# Altium schematic sheet 23_LMS2_RX1_BB_ADC.SchDoc: LMS2 RX1 BB ADC
size A3; Organization: Lime Microsystems; Address1: Surrey Tech Centre; Address2: Guildford GU2 7YG; Address3: Surrey; Address4: United Kingdom; Revision: v1.1; SheetNumber: 23; SheetTotal: 31
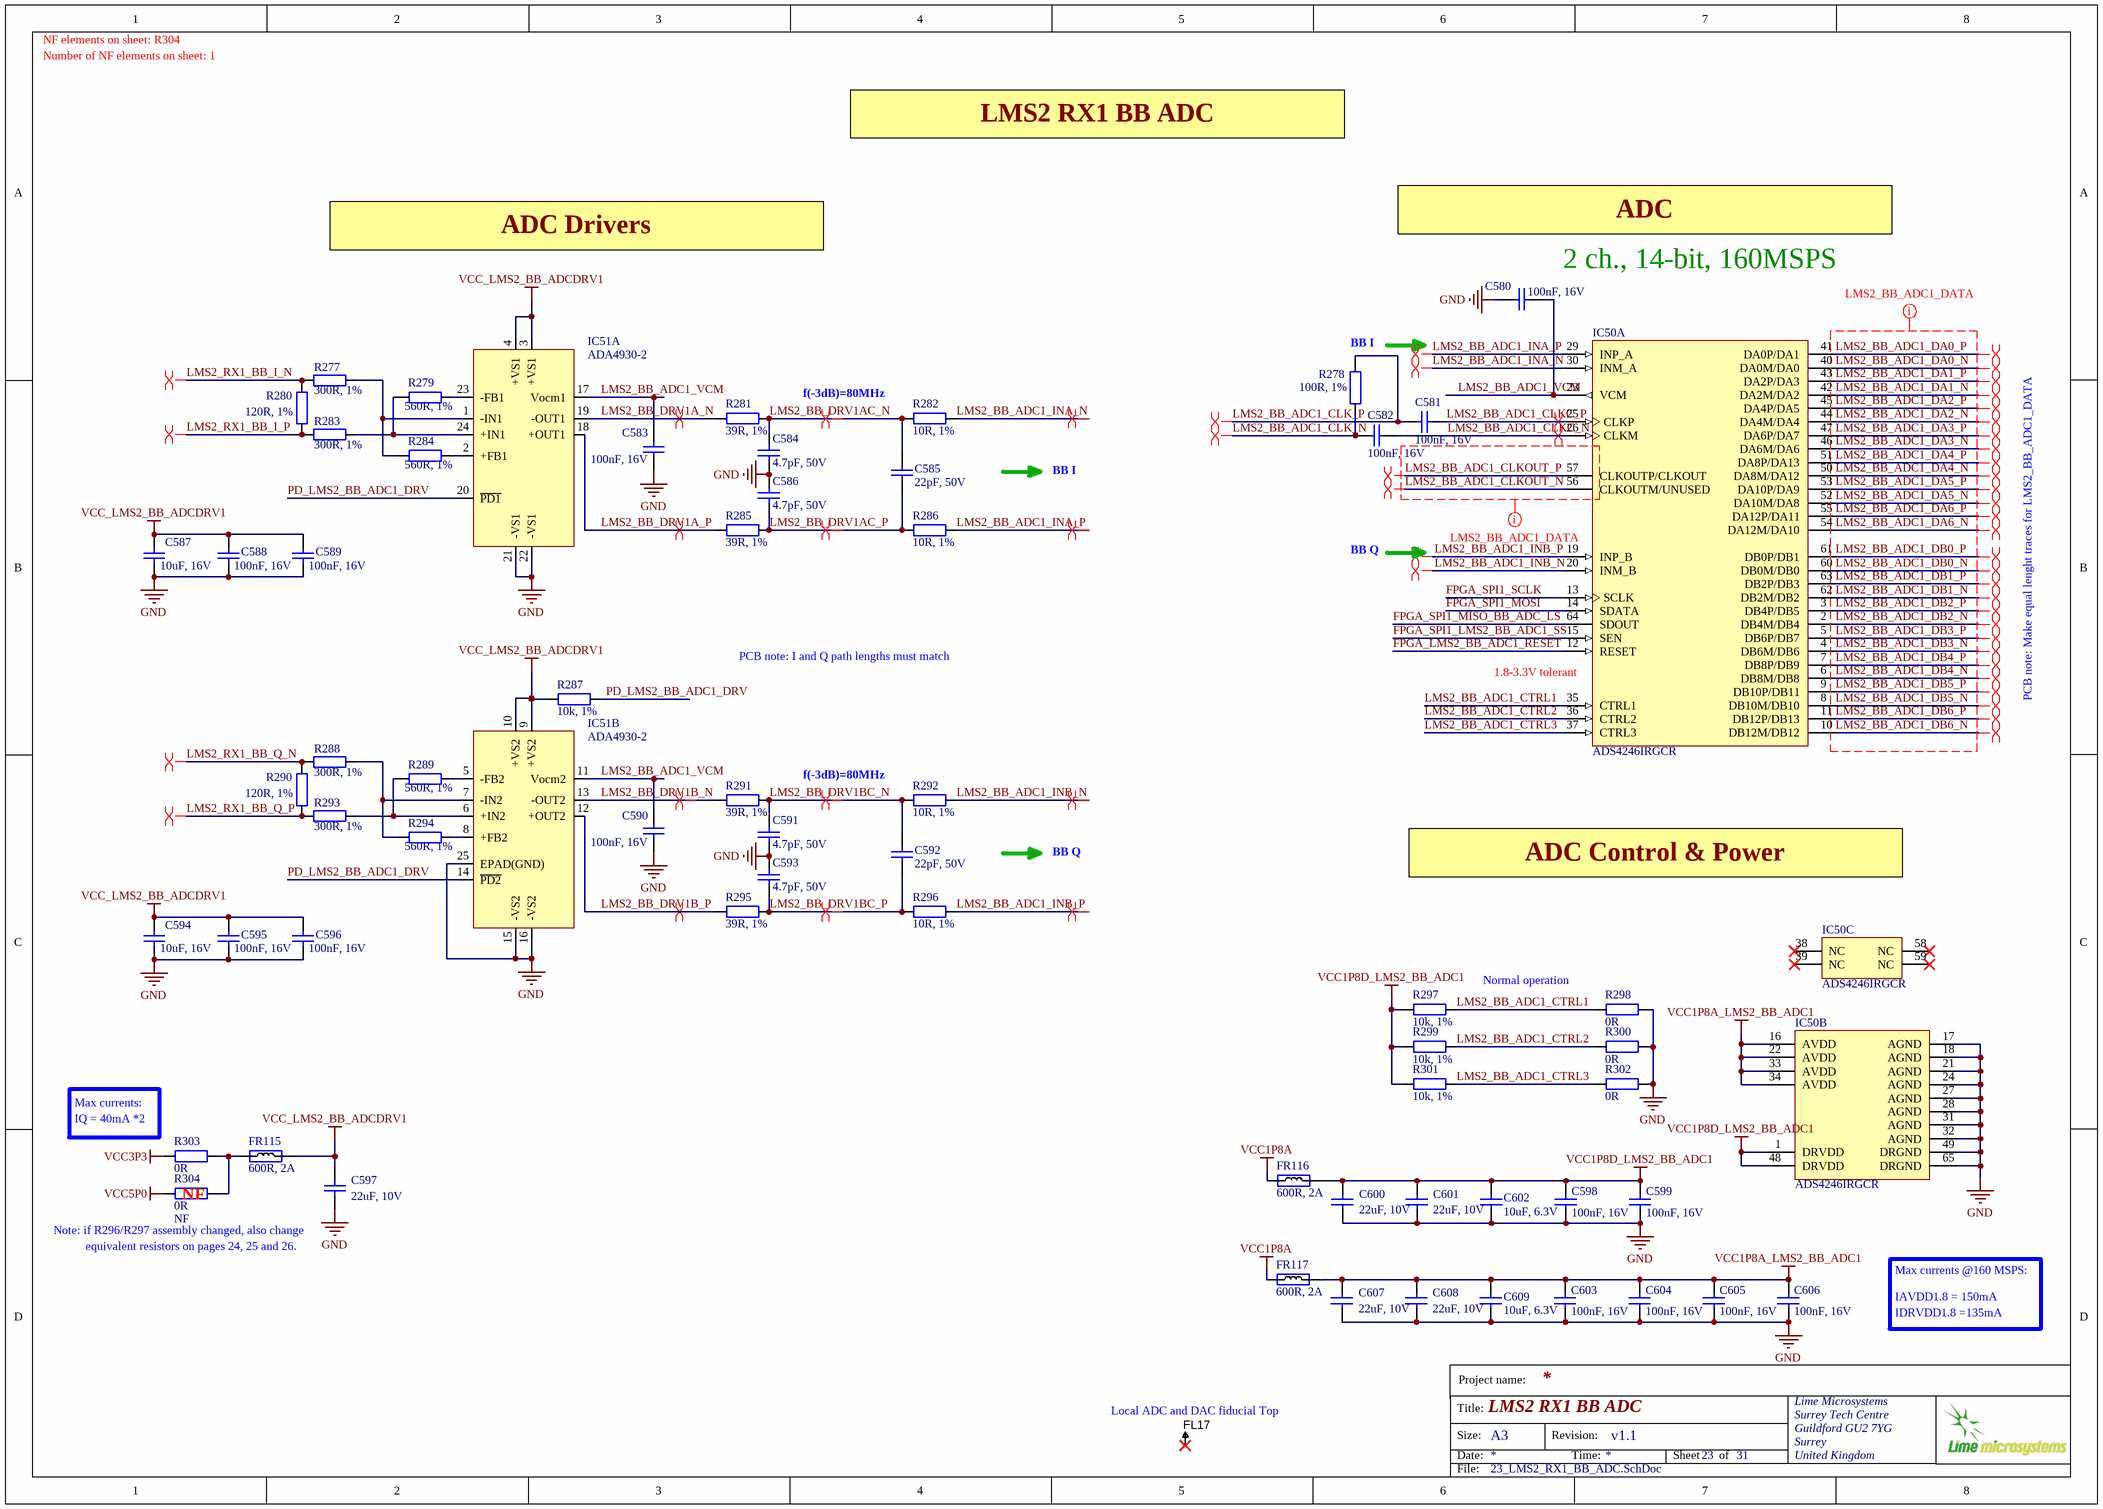
[diagram p0: 23_LMS2_RX1_BB_ADC.SchDoc]

## Parts
C580  100nF, 16V  [CAP0402]
C581  100nF, 16V  [CAP0402]
C582  100nF, 16V  [CAP0402]
C583  100nF, 16V  [CAP0402]
C584  4.7pF, 50V  [CAP0402]
C585  22pF, 50V  [CAP0402]
C586  4.7pF, 50V  [CAP0402]
C587  10uF, 16V  [CAP0603]
C588  100nF, 16V  [CAP0402]
C589  100nF, 16V  [CAP0402]
C590  100nF, 16V  [CAP0402]
C591  4.7pF, 50V  [CAP0402]
C592  22pF, 50V  [CAP0402]
C593  4.7pF, 50V  [CAP0402]
C594  10uF, 16V  [CAP0603]
C595  100nF, 16V  [CAP0402]
C596  100nF, 16V  [CAP0402]
C597  22uF, 10V  [CAP0603]
C598  100nF, 16V  [CAP0402]
C599  100nF, 16V  [CAP0402]
C600  22uF, 10V  [CAP0603]
C601  22uF, 10V  [CAP0603]
C602  10uF, 6.3V  [CAP0603]
C603  100nF, 16V  [CAP0402]
C604  100nF, 16V  [CAP0402]
C605  100nF, 16V  [CAP0402]
C606  100nF, 16V  [CAP0402]
C607  22uF, 10V  [CAP0603]
C608  22uF, 10V  [CAP0603]
C609  10uF, 6.3V  [CAP0603]
FL17  Fiducial  [Fiducial_local]  (value not drawn)
FR115  600R, 2A  [RES0805]
FR116  600R, 2A  [RES0805]
FR117  600R, 2A  [RES0805]
IC50  ADS4246IRGCR  [TI-RGC64-7400X7400TP_V]  (parts A,B,C of 3)
IC51  ADA4930-2  [ADA4930-2_LFCSP-24]  (parts A,B of 2)
R277  300R, 1%  [RES0402]
R278  100R, 1%  [RES0402]
R279  560R, 1%  [RES0402]
R280  120R, 1%  [RES0402]
R281  39R, 1%  [RES0402]
R282  10R, 1%  [RES0402]
R283  300R, 1%  [RES0402]
R284  560R, 1%  [RES0402]
R285  39R, 1%  [RES0402]
R286  10R, 1%  [RES0402]
R287  10k, 1%  [RES0402]
R288  300R, 1%  [RES0402]
R289  560R, 1%  [RES0402]
R290  120R, 1%  [RES0402]
R291  39R, 1%  [RES0402]
R292  10R, 1%  [RES0402]
R293  300R, 1%  [RES0402]
R294  560R, 1%  [RES0402]
R295  39R, 1%  [RES0402]
R296  10R, 1%  [RES0402]
R297  10k, 1%  [RES0402]
R298  0R  [RES0402]
R299  10k, 1%  [RES0402]
R300  0R  [RES0402]
R301  10k, 1%  [RES0402]
R302  0R  [RES0402]
R303  0R  [RES0402]
R304  0R  Assembly Info: NF  [RES0402]

## Nets
GND: C580.1 C583.2 C584.2 C586.1 C587.1 C588.2 C589.2 C590.2 C591.2 C593.1 C594.1 C595.2 C596.2 C597.1 C598.1 C599.1 C600.1 C601.1 C602.2 C603.1 C604.1 C605.1 C606.1 C607.1 C608.1 C609.2 IC50.17(AGND) IC50.18(AGND) IC50.21(AGND) IC50.24(AGND) IC50.27(AGND) IC50.28(AGND) IC50.31(AGND) IC50.32(AGND) IC50.49(DRGND) IC50.65(DRGND) IC51.15(-VS2) IC51.16(-VS2) IC51.21(-VS1) IC51.22(-VS1) IC51.25(EPAD(GND)) R298.1 R300.1 R302.1
VCC1P8A: FR116.1 FR117.1
VCC1P8A_LMS2_BB_ADC1: C603.2 C604.2 C605.2 C606.2 C607.2 C608.2 C609.1 FR117.2 IC50.16(AVDD) IC50.22(AVDD) IC50.33(AVDD) IC50.34(AVDD)
VCC1P8D_LMS2_BB_ADC1: C598.2 C599.2 C600.2 C601.2 C602.1 FR116.2 IC50.1(DRVDD) IC50.48(DRVDD) R297.2 R299.2 R301.2
VCC3P3: R303.2
VCC5P0: R304.2
VCC_LMS2_BB_ADCDRV1: C587.2 C588.1 C589.1 C594.2 C595.1 C596.1 C597.2 FR115.2 IC51.3(+VS1) IC51.4(+VS1) IC51.9(+VS2) IC51.10(+VS2) R287.2
FPGA_LMS2_BB_ADC1_RESET: IC50.12(RESET)
FPGA_SPI1_LMS2_BB_ADC1_SS: IC50.15(SEN)
FPGA_SPI1_MISO_BB_ADC_LS: IC50.64(SDOUT)
FPGA_SPI1_MOSI: IC50.14(SDATA)
FPGA_SPI1_SCLK: IC50.13(SCLK)
LMS2_BB_ADC1_CLK_N: C582.2 R278.1
LMS2_BB_ADC1_CLK_P: C581.2 R278.2
LMS2_BB_ADC1_CLKC_N: C582.1 IC50.26(CLKM)
LMS2_BB_ADC1_CLKC_P: C581.1 IC50.25(CLKP)
LMS2_BB_ADC1_CLKOUT_N: IC50.56(CLKOUTM/UNUSED)
LMS2_BB_ADC1_CLKOUT_P: IC50.57(CLKOUTP/CLKOUT)
LMS2_BB_ADC1_CTRL1: IC50.35(CTRL1) R297.1 R298.2
LMS2_BB_ADC1_CTRL2: IC50.36(CTRL2) R299.1 R300.2
LMS2_BB_ADC1_CTRL3: IC50.37(CTRL3) R301.1 R302.2
LMS2_BB_ADC1_DA0_N: IC50.40(DA0M/DA0)
LMS2_BB_ADC1_DA0_P: IC50.41(DA0P/DA1)
LMS2_BB_ADC1_DA1_N: IC50.42(DA2M/DA2)
LMS2_BB_ADC1_DA1_P: IC50.43(DA2P/DA3)
LMS2_BB_ADC1_DA2_N: IC50.44(DA4M/DA4)
LMS2_BB_ADC1_DA2_P: IC50.45(DA4P/DA5)
LMS2_BB_ADC1_DA3_N: IC50.46(DA6M/DA6)
LMS2_BB_ADC1_DA3_P: IC50.47(DA6P/DA7)
LMS2_BB_ADC1_DA4_N: IC50.50(DA8M/DA12)
LMS2_BB_ADC1_DA4_P: IC50.51(DA8P/DA13)
LMS2_BB_ADC1_DA5_N: IC50.52(DA10M/DA8)
LMS2_BB_ADC1_DA5_P: IC50.53(DA10P/DA9)
LMS2_BB_ADC1_DA6_N: IC50.54(DA12M/DA10)
LMS2_BB_ADC1_DA6_P: IC50.55(DA12P/DA11)
LMS2_BB_ADC1_DB0_N: IC50.60(DB0M/DB0)
LMS2_BB_ADC1_DB0_P: IC50.61(DB0P/DB1)
LMS2_BB_ADC1_DB1_N: IC50.62(DB2M/DB2)
LMS2_BB_ADC1_DB1_P: IC50.63(DB2P/DB3)
LMS2_BB_ADC1_DB2_N: IC50.2(DB4M/DB4)
LMS2_BB_ADC1_DB2_P: IC50.3(DB4P/DB5)
LMS2_BB_ADC1_DB3_N: IC50.4(DB6M/DB6)
LMS2_BB_ADC1_DB3_P: IC50.5(DB6P/DB7)
LMS2_BB_ADC1_DB4_N: IC50.6(DB8M/DB8)
LMS2_BB_ADC1_DB4_P: IC50.7(DB8P/DB9)
LMS2_BB_ADC1_DB5_N: IC50.8(DB10M/DB10)
LMS2_BB_ADC1_DB5_P: IC50.9(DB10P/DB11)
LMS2_BB_ADC1_DB6_N: IC50.10(DB12M/DB12)
LMS2_BB_ADC1_DB6_P: IC50.11(DB12P/DB13)
LMS2_BB_ADC1_INA_N: IC50.30(INM_A) R282.1
LMS2_BB_ADC1_INA_P: IC50.29(INP_A) R286.1
LMS2_BB_ADC1_INB_N: IC50.20(INM_B) R292.1
LMS2_BB_ADC1_INB_P: IC50.19(INP_B) R296.1
LMS2_BB_ADC1_VCM: C580.2 C583.1 C590.1 IC50.23(VCM) IC51.11(Vocm2) IC51.17(Vocm1)
LMS2_BB_DRV1A_N: IC51.19(-OUT1) R281.2
LMS2_BB_DRV1A_P: IC51.18(+OUT1) R285.2
LMS2_BB_DRV1AC_N: C584.1 C585.1 R281.1 R282.2
LMS2_BB_DRV1AC_P: C585.2 C586.2 R285.1 R286.2
LMS2_BB_DRV1B_N: IC51.13(-OUT2) R291.2
LMS2_BB_DRV1B_P: IC51.12(+OUT2) R295.2
LMS2_BB_DRV1BC_N: C591.1 C592.1 R291.1 R292.2
LMS2_BB_DRV1BC_P: C592.2 C593.2 R295.1 R296.2
LMS2_RX1_BB_I_N: R277.2 R280.2
LMS2_RX1_BB_I_P: R280.1 R283.2
LMS2_RX1_BB_Q_N: R288.2 R290.2
LMS2_RX1_BB_Q_P: R290.1 R293.2
PD_LMS2_BB_ADC1_DRV: IC51.14(~{PD2}) IC51.20(~{PD1}) R287.1
NetFR115_1: FR115.1 R303.1 R304.1
NetIC51_1: IC51.1(-IN1) R277.1 R284.2
NetIC51_2: IC51.2(+FB1) R284.1
NetIC51_5: IC51.5(-FB2) R289.1
NetIC51_6: IC51.6(+IN2) R289.2 R293.1
NetIC51_7: IC51.7(-IN2) R288.1 R294.2
NetIC51_8: IC51.8(+FB2) R294.1
NetIC51_23: IC51.23(-FB1) R279.1
NetIC51_24: IC51.24(+IN1) R279.2 R283.1

Not connected (* = marked no-connect by the designer): FL17 1*; IC50 38(NC)* 39(NC)* 58(NC)* 59(NC)*

## Layout directives
net class LMS2_BB_ADC1_DATA: LMS2_BB_ADC1_CLKOUT_N, LMS2_BB_ADC1_CLKOUT_P, LMS2_BB_ADC1_DA0_N, LMS2_BB_ADC1_DA0_P, LMS2_BB_ADC1_DA1_N, LMS2_BB_ADC1_DA1_P, LMS2_BB_ADC1_DA2_N, LMS2_BB_ADC1_DA2_P, LMS2_BB_ADC1_DA3_N, LMS2_BB_ADC1_DA3_P, LMS2_BB_ADC1_DA4_N, LMS2_BB_ADC1_DA4_P, LMS2_BB_ADC1_DA5_N, LMS2_BB_ADC1_DA5_P, LMS2_BB_ADC1_DA6_N, LMS2_BB_ADC1_DA6_P, LMS2_BB_ADC1_DB0_N, LMS2_BB_ADC1_DB0_P, LMS2_BB_ADC1_DB1_N, LMS2_BB_ADC1_DB1_P, LMS2_BB_ADC1_DB2_N, LMS2_BB_ADC1_DB2_P, LMS2_BB_ADC1_DB3_N, LMS2_BB_ADC1_DB3_P, LMS2_BB_ADC1_DB4_N, LMS2_BB_ADC1_DB4_P, LMS2_BB_ADC1_DB5_N, LMS2_BB_ADC1_DB5_P, LMS2_BB_ADC1_DB6_N, LMS2_BB_ADC1_DB6_P
differential pair: LMS2_BB_ADC1_CLK_N, LMS2_BB_ADC1_CLK_P, LMS2_BB_ADC1_CLKC_N, LMS2_BB_ADC1_CLKC_P, LMS2_BB_ADC1_CLKOUT_N, LMS2_BB_ADC1_CLKOUT_P, LMS2_BB_ADC1_DA0_N, LMS2_BB_ADC1_DA0_P, LMS2_BB_ADC1_DA1_N, LMS2_BB_ADC1_DA1_P, LMS2_BB_ADC1_DA2_N, LMS2_BB_ADC1_DA2_P, LMS2_BB_ADC1_DA3_N, LMS2_BB_ADC1_DA3_P, LMS2_BB_ADC1_DA4_N, LMS2_BB_ADC1_DA4_P, LMS2_BB_ADC1_DA5_N, LMS2_BB_ADC1_DA5_P, LMS2_BB_ADC1_DA6_N, LMS2_BB_ADC1_DA6_P, LMS2_BB_ADC1_DB0_N, LMS2_BB_ADC1_DB0_P, LMS2_BB_ADC1_DB1_N, LMS2_BB_ADC1_DB1_P, LMS2_BB_ADC1_DB2_N, LMS2_BB_ADC1_DB2_P, LMS2_BB_ADC1_DB3_N, LMS2_BB_ADC1_DB3_P, LMS2_BB_ADC1_DB4_N, LMS2_BB_ADC1_DB4_P, LMS2_BB_ADC1_DB5_N, LMS2_BB_ADC1_DB5_P, LMS2_BB_ADC1_DB6_N, LMS2_BB_ADC1_DB6_P, LMS2_BB_ADC1_INA_N, LMS2_BB_ADC1_INA_P, LMS2_BB_ADC1_INB_N, LMS2_BB_ADC1_INB_P, LMS2_BB_DRV1A_N, LMS2_BB_DRV1A_P, LMS2_BB_DRV1AC_N, LMS2_BB_DRV1AC_P, LMS2_BB_DRV1B_N, LMS2_BB_DRV1B_P, LMS2_BB_DRV1BC_N, LMS2_BB_DRV1BC_P, LMS2_RX1_BB_I_N, LMS2_RX1_BB_I_P, LMS2_RX1_BB_Q_N, LMS2_RX1_BB_Q_P

## Notes on the sheet
- NF elements on sheet: R304
- Number of NF elements on sheet: 1
- LMS2 RX1 BB ADC
- ADC Drivers
- ADC
- (near C580) 2 ch., 14-bit, 160MSPS
- (near R278) BB I
- f(-3dB)=80MHz
- BB I
- BB Q
- PCB note: I and Q path lengths must match
- (near IC50) 1.8-3.3V tolerant
- PCB note: Make equal lenght traces for LMS2_BB_ADC1_DATA
- ADC Control & Power
- Normal operation
- (near R303) IQ = 40mA *2
- (near R303) Max currents:
- Note: if R296/R297 assembly changed, also change
- equivalent resistors on pages 24, 25 and 26.
- (near R304) NF
- IAVDD1.8 = 150mA
- IDRVDD1.8 =135mA
- Max currents @160 MSPS:
- (near FL17) Local ADC and DAC fiducial Top
- Project name:
- Title:
- Size:
- Date:
- A3
- Revision:
- Time:
- Sheet
- of
- File:

## Library data of the parts
C580-C583 C590 C598 C599 C603-C606 = Cap_0603: Part Description: 0.10µF ±10% 16V X7R Ceramic Capacitor -55°C ~ 125°C Surface Mount, MLCC 0402 (1005 Metric) 0.039" L x 0.020" W (1.00mm x 0.50mm); Manufacturer Part Number 1: GRM155R71C104KA88D; Brand: Murata Electronics; Tolerance: 10 %; Type: General Purpose MLCC; Capacitance: 0.1 uF; Temperature Coefficient / Code: +/- 15 %; Case Height: 0.5 mm; Case Length: 1 mm; Dielectric: X7R; Supplier 1: Mouser; Supplier Part Number 1: 81-GRM155R71C104KA88; Case Code - in: 0402; Manufacturer: Murata Electronics; Category: Multilayer Ceramic Capacitors MLCC - SMD/SMT; Voltage Rating DC: 16 V; Value: 100nF, 16V; Case Code - mm: 1005; Case Width: 0.5 mm; Maximum Operating Temperature: + 125 C; Minimum Operating Temperature: - 55 C; Minimum Order Quantity: 1; Operating Temperature Range: - 55 C to + 125 C; Package / Case: 0402 (1005 metric); Packaging: Reel; Product: General Type MLCCs; Product Category: Low & Medium Capacitance SMD Ceramic Chip Capacitors; Reeling: True; RoHS - Mouser: Y; RoHS: RoHS Compliant; Series: GRM; Standard Pack Qty: 10000; Termination Style: SMD/SMT
C584 C586 C591 C593 = Cap_0402: Manufacturer: MURATA; Manufacturer Part Number 1: GRM1555C1H4R7CA01D; Part Description: 4.7pF ±0.25pF 50V Ceramic Capacitor C0G, NP0 0402 (1005 Metric); Capacitance Tolerance: ± 0.25; Voltage Rating: 50; Dielectric Characteristic: C0G / NP0; Ceramic Capacitor Case: 0402 [1005 Metric]; Capacitance: 4.7; SVHC: No SVHC (15-Jun-2015; Product Range: GRM Series; Value: 4.7pF, 50V; Supplier 1: Farnell; Supplier Part Number 1: 2434644; Operating Temperature Max: 125; Operating Temperature Min: -55; MSL: MSL 1 - Unlimited; RoHS: YES; Packaging: Cut Tape
C585 C592 = Cap_0402: Manufacturer: Yageo; Manufacturer Part Number 1: CC0402JRNPO9BN220; Part Description: 22pF ±5% 50V C0G, NP0 Ceramic Capacitor -55°C ~ 125°C Surface Mount, MLCC 0402 (1005 Metric) 0.039" L x 0.020" W (1.00mm x 0.50mm); Tolerance: ±5%; Temperature Coefficient: C0G, NP0; Value: 22pF, 50V; Supplier 1: Digi-Key; Supplier Part Number 1: 311-1018-2-ND; Category: Capacitors; Voltage - Rated: 50V; Packaging: Tape & Reel (TR); RoHS: RoHS Compliant; Capacitance: 22pF; Operating Temperature: -55°C ~ 125°C; Mounting Type: Surface Mount, MLCC; Height - Seated (Max): -; Size / Dimension: 0.039" L x 0.020" W (1.00mm x 0.50mm); Ratings: -; Applications: General Purpose; Thickness (Max): 0.022" (0.55mm); Lead Spacing: -; Lead Style: -; Features: -; Package / Case: 0402 (1005 Metric)
C587 C594 = Cap_0603: Manufacturer: Yageo; Manufacturer Part Number 1: GRM188R61C106MA73D; Part Description: 10µF ±20% 16V Ceramic Capacitor X5R 0603 (1608 Metric); Temperature Coefficient: X5R; Capacitance: 10µF; Tolerance: ±20%; Value: 10uF, 16V; Supplier 1: Digi-Key; Supplier Part Number 1: 490-7201-2-ND; Category: Capacitors; Ratings: -; Features: -; Lead Style: -; Package / Case: 0603 (1608 Metric); Lead Spacing: -; Applications: General Purpose; Voltage - Rated: 16V; Operating Temperature: -55°C ~ 85°C; Thickness (Max): 0.039" (1.00mm); Mounting Type: Surface Mount, MLCC; RoHS: RoHS Compliant; Size / Dimension: 0.063" L x 0.031" W (1.60mm x 0.80mm); Packaging: Tape & Reel (TR); Height - Seated (Max): -
C588 C589 C595 C596 = Cap_0603: Manufacturer Part Number 1: GRM155R71C104KA88D; Part Description: 0.10µF ±10% 16V X7R Ceramic Capacitor -55°C ~ 125°C Surface Mount, MLCC 0402 (1005 Metric) 0.039" L x 0.020" W (1.00mm x 0.50mm); Brand: Murata Electronics; Tolerance: 10 %; Type: General Purpose MLCC; Capacitance: 0.1 uF; Temperature Coefficient / Code: +/- 15 %; Case Height: 0.5 mm; Case Length: 1 mm; Dielectric: X7R; Supplier 1: Mouser; Supplier Part Number 1: 81-GRM155R71C104KA88; Case Code - in: 0402; Manufacturer: Murata Electronics; Category: Multilayer Ceramic Capacitors MLCC - SMD/SMT; Voltage Rating DC: 16 V; Value: 100nF, 16V; Case Code - mm: 1005; Case Width: 0.5 mm; Maximum Operating Temperature: + 125 C; Minimum Operating Temperature: - 55 C; Minimum Order Quantity: 1; Operating Temperature Range: - 55 C to + 125 C; Package / Case: 0402 (1005 metric); Packaging: Reel; Product: General Type MLCCs; Product Category: Low & Medium Capacitance SMD Ceramic Chip Capacitors; Reeling: True; RoHS - Mouser: Y; RoHS: RoHS Compliant; Series: GRM; Standard Pack Qty: 10000; Termination Style: SMD/SMT
C597 C600 C601 C607 C608 = Cap_0603: Manufacturer Part Number 1: C1608X5R1A226M080AC; Part Description: 22µF ±20% 10V Ceramic Capacitor X5R 0603 (1608 Metric); Manufacturer: TDK Corporation; Brand: TDK; Temperature Coefficient / Code: +/- 15 %; Tolerance: 20 %; Type: Multilayer Ceramic Chip Capacitor; Supplier 1: Mouser; Supplier Part Number 1: 810-C1608X5R1A226M; Package / Case: 0603 (1608 metric); Category: Multilayer Ceramic Capacitors MLCC - SMD/SMT; Capacitance: 22uF; Operating Temperature Range: - 55 C to + 85 C; Case Code - in: 0603; Voltage Rating DC: 10 V; Case Code - mm: 1608; Value: 22uF, 10V
C602 C609 = Cap_0603: Manufacturer Part Number 1: CC0603MRX5R5BB106; Part Description: 10µF ±20% 6.3V X5R Ceramic Capacitor -55°C ~ 85°C Surface Mount, MLCC 0603 (1608 Metric) 0.063" L x 0.031" W (1.60mm x 0.80mm); Manufacturer: Yageo; Capacitance: 10µF; Tolerance: ±20%; Supplier 1: Digi-Key; Supplier Part Number 1: 311-1448-2-ND; Package / Case: 0603 (1608 Metric); Category: Capacitors; Voltage - Rated: 6.3V; Value: 10uF, 6.3V
FR115 = Ferrite: Manufacturer Part Number 1: MPZ2012S601AT000; Manufacturer: TDK Corporation; Part Description: FERRITE BEAD 600 OHM 0805 1LN; Filter Type: Differential Mode - Single; Impedance @ Frequency: 600 Ohm @ 100MHz; DC Resistance (DCR): 100 mOhm Max; Supplier 1: Digi-Key; Supplier Part Number 1: 445-2206-2-ND; Mounting Type: Surface Mount; RoHS: RoHS Compliant; Height (Max): 0.041" (1.05mm); Packaging: Tape & Reel (TR); Category: Filters; Current Rating: 2A; Package / Case: 0805 (2012 Metric); Size / Dimension: 0.079" L x 0.049" W (2.00mm x 1.25mm); Value: 600R, 2A
FR116 FR117 = Ferrite: Manufacturer Part Number 1: MPZ2012S601AT000; Manufacturer: TDK Corporation; Part Description: FERRITE BEAD 600 OHM 0805 1LN; DC Resistance (DCR): 100 mOhm Max; Filter Type: Differential Mode - Single; Impedance @ Frequency: 600 Ohm @ 100MHz; Supplier 1: Digi-Key; Supplier Part Number 1: 445-2206-2-ND; Value: 600R, 2A; Category: Filters; Current Rating: 2A; Height (Max): 0.041" (1.05mm); Mounting Type: Surface Mount; Package / Case: 0805 (2012 Metric); Packaging: Tape & Reel (TR); RoHS: RoHS Compliant; Size / Dimension: 0.079" L x 0.049" W (2.00mm x 1.25mm)
IC50 = ADS4246IRGCR: 14-Bit 160 MSPS Dual Low Power ADC, -40 to 85 degC, 64-pin QFN (RGC64), Green (RoHS & no Sb/Br); Manufacturer: Texas Instruments; Manufacturer Part Number 1: ADS4246IRGCT; Part Description: 14 Bit Analog to Digital Converter 2 Input 2 Pipelined 64-VQFN (9x9); Number of Bits: 14; Sampling Rate (Per Second): 160M; Number of Inputs: 2; Input Type: Differential; Data Interface: LVDS - Parallel, Parallel; Configuration: S/H-ADC; Ratio - S/H:ADC: 1:1; Architecture: Pipelined; Reference Type: Internal; Voltage - Supply, Analog: 1.7 V ~ 1.9 V; Supplier 1: Digi-Key; Supplier Part Number 1: 296-28772-1-ND; RoHS: RoHS Compliant; Category: Integrated Circuits (ICs); Stock 1: 83; Pricing 1: 1=95.91, 10=90.96, 100=82.2967 (USD); Packaging: Cut Tape (CT); Part Status: Active; Number of A/D Converters: 2; Voltage - Supply, Digital: 1.7 V ~ 1.9 V; Features: Simultaneous Sampling; Operating Temperature: -40°C ~ 85°C; Package / Case: 64-VFQFN Exposed Pad; Supplier Device Package: 64-VQFN (9x9); ComponentLink1URL: http://www.ti.com/lit/ds/symlink/ads4246.pdf; ComponentLink1Description: http://www.ti.com/lit/ds/symlink/ads4246.pdf
IC51 = ADA4930-2: Manufacturer: Analog Devices Inc.; Manufacturer Part Number 1: ADA4930-2YCPZ-R7; Part Description: Differential Amplifier 2 Circuit Differential 24-LFCSP-WQ (4x4); Amplifier Type: Differential; Voltage - Supply, Single/Dual (±): 3.3V, 5V; Number of Circuits: 2; Current - Supply: 34mA; Slew Rate: 3400 V/µs; Voltage - Input Offset: 150µV; Current - Input Bias: 23µA; -3db Bandwidth: 1.35GHz; Current - Output / Channel: 30mA; Supplier 1: Digi-Key; Mounting Type: Surface Mount; Gain Bandwidth Product: -; Supplier Device Package: 24-LFCSP-VQ (4x4); Category: Integrated Circuits (ICs); Operating Temperature: -40°C ~ 105°C; Packaging: Cut Tape (CT); RoHS: RoHS Compliant; Package / Case: 24-VFQFN Exposed Pad, CSP; Output Type: Differential; Supplier Part Number 1: ADA4930-2YCPZ-R7CT-ND
R277 R283 R288 R293 = Res_0402: Manufacturer: Vishay Dale; Part Description: RES SMD 300 OHM 1% 1/16W 0402; Manufacturer Part Number 1: CRCW0402300RFKED; Resistance (Ohms): 300; Temperature Coefficient: ±100ppm/°C; Power (Watts): 0.063W, 1/16W; Value: 300R, 1%; Supplier 1: Digi-Key; Supplier Device Package: 0402 (1005 Metric); Composition: Thick Film; Features: Automotive AEC-Q200; Packaging: Cut Tape (CT); Size / Dimension: 0.039" L x 0.020" W (1.00mm x 0.50mm); Category: Resistors; Package / Case: 0402 (1005 Metric); Supplier Part Number 1: 541-300LCT-ND; Number of Terminations: 2; Tolerance: ±1%; Height: 0.016" (0.40mm); Operating Temperature: -55°C ~ 155°C; RoHS: RoHS Compliant
R278 = Res_0402: Manufacturer Part Number 1: RMCF0402FT100R; Part Description: RES SMD 100 OHM 1% 1/16W 0402; Manufacturer: Stackpole Electronics Inc.; Temperature Coefficient: ±100ppm/°C; Supplier 1: Digi-Key; Supplier Part Number 1: RMCF0402FT100RDKR-ND; Package / Case: 0402 (1005 Metric); Composition: Thick Film; Category: Resistors; Tolerance: ±1%; Value: 100R, 1%
R279 R284 R289 R294 = Res_0402: Manufacturer: Vishay Dale; Part Description: RES SMD 560 OHM 1% 1/16W 0402; Manufacturer Part Number 1: CRCW0402560RFKED; Resistance (Ohms): 560; Temperature Coefficient: ±100ppm/°C; Power (Watts): 0.063W, 1/16W; Value: 560R, 1%; Supplier Device Package: 0402 (1005 Metric); Composition: Thick Film; Packaging: Cut Tape (CT); Number of Terminations: 2; Operating Temperature: -55°C ~ 155°C; Supplier Part Number 1: 541-560LCT-ND; Supplier 1: Digi-Key; Category: Resistors; Height: 0.016" (0.40mm); Features: Automotive AEC-Q200; Size / Dimension: 0.039" L x 0.020" W (1.00mm x 0.50mm); Tolerance: ±1%; Package / Case: 0402 (1005 Metric); RoHS: RoHS Compliant
R280 R290 = Res_0402: Manufacturer: Yageo; Manufacturer Part Number 1: RC0402FR-07120RL; Part Description: 120 Ohms ±1% 0.063W, 1/16W Chip Resistor 0402 (1005 Metric) Moisture Resistant Thick Film; Power Rating: 62.5mW; Voltage Rating: 50V; Temperature Coefficient: 100ppm/°C; Max Power Dissipation: 63mW; Value: 120R, 1%; Supplier 1: Digi-Key; Supplier Part Number 1: 311-120LRCT-ND; Stock 1: 1593308; Pricing 1: 1=0.1, 10=0.016, 100=0.0067, 1000=0.00301, 2500=0.00261, 5000=0.00215 (USD); Case/Package: 0402; Case Code (Imperial): 0402; Case Code (Metric): 1005; Min Operating Temperature: -55°C; Max Operating Temperature: 155°C; Package Quantity: 1; Resistance: 120R; Tolerance: 1%; Packaging: Tape and Reel; Termination: SMD/SMT; Composition: Thick Film; Number of Terminations: 2; Military Standard: Not; Features: Moisture Resistant; Length: 1mm; Height: 0.016inch; Width: 0.02inch; Depth: 0.5mm; REACH SVHC: No SVHC; Lead Free: Lead Free; ComponentLink1URL: http://www.farnell.com/datasheets/1018594.pdf?src-supplier=Element14; ComponentLink1Description: http://www.farnell.com/datasheets/1018594.pdf?src-supplier=Element14; ComponentLink2URL: http://www.mouser.com/ds/2/447/PYu-RC0402_51_RoHS_L_6_r-8721.pdf?src-supplier=Mouser; ComponentLink2Description: http://www.mouser.com/ds/2/447/PYu-RC0402_51_RoHS_L_6_r-8721.pdf?src-supplier=Mouser; ComponentLink3URL: http://documents.rs-components.com/techlib://itc_doclist_GB.htm?stockno=6185898&src-supplier=RSComponents; ComponentLink3Description: http://documents.rs-components.com/techlib://itc_doclist_GB.htm?stockno=6185898&src-supplier=RSComponents; ComponentLink4URL: http://www.yageo.com/documents/recent/PYu-RC_Group_51_RoHS_L_10.pdf?src-supplier=Digi-Key; ComponentLink4Description: http://www.yageo.com/documents/recent/PYu-RC_Group_51_RoHS_L_10.pdf?src-supplier=Digi-Key; ComponentLink5URL: http://www.yageo.com/documents/recent/PYu-RC0402_51_RoHS_L_6_r.pdf?src-supplier=Future+Electronics; ComponentLink5Description: http://www.yageo.com/documents/recent/PYu-RC0402_51_RoHS_L_6_r.pdf?src-supplier=Future+Electronics
R281 R285 R291 R295 = Res_0402: Manufacturer: Yageo; Manufacturer Part Number 1: RC0402FR-0739RL; Part Description: 39 Ohms ±1% 0.063W, 1/16W Chip Resistor 0402 (1005 Metric) Moisture Resistant Thick Film; Power Rating: 63mW; Voltage Rating: 50V; Temperature Coefficient: 100ppm/°C; Value: 39R, 1%; ComponentLink1URL: http://www.yageo.com.tw/exep/pages/download/literatures/PYu-R_INT-thick_7.pdf?src-supplier=Digi-Key; ComponentLink1Description: http://www.yageo.com.tw/exep/pages/download/literatures/PYu-R_INT-thick_7.pdf?src-supplier=Digi-Key; ComponentLink2URL: http://www.yageo.com/NewPortal/yageodocoutput?fileName=/pdf/R-Chip/PYu-RC_51_RoHS_P_0.pdf&src-supplier=Digi-Key; ComponentLink2Description: http://www.yageo.com/NewPortal/yageodocoutput?fileName=/pdf/R-Chip/PYu-RC_51_RoHS_P_0.pdf&src-supplier=Digi-Key; Supplier 1: Digi-Key; Supplier Part Number 1: 311-39.0LRCT-ND; Stock 1: 1060646; Pricing 1: 1=0,10000, 10=0,01600, 100=0,00660, 1000=0,00299, 2500=0,00259, 5000=0,00214 (USD); RoHS: Yes; Case/Package: 0402; Case Code (Imperial): 0402; Case Code (Metric): 1005; Weight: 2.3E-05oz; Contact Plating: Tin,Matte; Min Operating Temperature: -55°C; Max Operating Temperature: 155°C; Tolerance: 1%; Package Quantity: 1; Packaging: Tape and Reel; Features: Moisture Resistant; Resistance: 39R; Termination: SMD/SMT; Resistor Type: Thick Film; Number of Terminations: 2; Max Power Dissipation: 63mW; Working Voltage: 50V; Series: RC; Resistance Tolerance: 1%; Construction: Rectangular; Technology: THICK FILM; Length: 1mm; Width: 0.5mm; Height: 0.016inch; Depth: 0.5mm; Radiation Hardening: No; Lead Free: Lead Free; REACH SVHC: Unknown; Military Standard: Not; RoHS Compliant: Yes; ComponentLink3URL: https://datasheet.ciiva.com/11819/0900766b80c66297-11819479.pdf?src-supplier=RSComponents; ComponentLink3Description: https://datasheet.ciiva.com/11819/0900766b80c66297-11819479.pdf?src-supplier=RSComponents; ComponentLink4URL: https://datasheet.ciiva.com/2519/pyu-r-int-thick-7-2519001.pdf?src-supplier=Digi-Key; ComponentLink4Description: https://datasheet.ciiva.com/2519/pyu-r-int-thick-7-2519001.pdf?src-supplier=Digi-Key; ComponentLink5URL: https://datasheet.ciiva.com/2519/pyu-r-int-thick-7-2519002.pdf?src-supplier=Digi-Key; ComponentLink5Description: https://datasheet.ciiva.com/2519/pyu-r-int-thick-7-2519002.pdf?src-supplier=Digi-Key; ComponentLink6URL: https://datasheet.ciiva.com/2519/pyu-r-int-thick-7-2519000.pdf?src-supplier=Digi-Key; ComponentLink6Description: https://datasheet.ciiva.com/2519/pyu-r-int-thick-7-2519000.pdf?src-supplier=Digi-Key; ComponentLink7URL: https://datasheet.ciiva.com/7849/1018594-7849983.pdf?src-supplier=Element14; ComponentLink7Description: https://datasheet.ciiva.com/7849/1018594-7849983.pdf?src-supplier=Element14; ComponentLink8URL: https://datasheet.ciiva.com/7849/1018594-7849982.pdf?src-supplier=Element14; ComponentLink8Description: https://datasheet.ciiva.com/7849/1018594-7849982.pdf?src-supplier=Element14; ComponentLink9URL: https://datasheet.ciiva.com/8889/pyu-rc0402-51-rohs-l-6-8889306.pdf?src-supplier=Avnet; ComponentLink9Description: https://datasheet.ciiva.com/8889/pyu-rc0402-51-rohs-l-6-8889306.pdf?src-supplier=Avnet; ComponentLink10URL: https://datasheet.ciiva.com/16741/pyu-rc0402-51-rohs-l-6-r-16741016.pdf?src-supplier=Future+Electronics; ComponentLink10Description: https://datasheet.ciiva.com/16741/pyu-rc0402-51-rohs-l-6-r-16741016.pdf?src-supplier=Future+Electronics; ComponentLink11URL: https://datasheet.ciiva.com/15189/getdatasheetpartid-325130-15189445.pdf?src-supplier=Verical; ComponentLink11Description: https://datasheet.ciiva.com/15189/getdatasheetpartid-325130-15189445.pdf?src-supplier=Verical
R282 R286 R292 R296 = Res_0402: Manufacturer 1: Yageo; Manufacturer Part Number 1: RC0402FR-0710RP; Part Description: 10 Ohms ±1% 0.063W, 1/16W Chip Resistor 0402 (1005 Metric) - Thick Film; Temperature Coefficient: 350ppm/°C; Max Power Dissipation: 63mW; Value: 10R, 1%; Supplier 1: Digi-Key; Supplier Part Number 1: YAG1250CT-ND; Stock 1: 35341; Pricing 1: 1=0,10000, 10=0,04200, 100=0,01700, 1000=0,00765, 2500=0,00664, 5000=0,00548 (USD); RoHS: Yes; Case/Package: 0402; Case Code (Metric): 1005; Case Code (Imperial): 0402; Min Operating Temperature: -55°C; Max Operating Temperature: 155°C; Packaging: Tape and Reel; Resistance: 10R; Resistor Type: Thick Film; Number of Terminations: 2; Tolerance: 1%; Features: Moisture Resistant; Length: 0.039inch; Width: 0.02inch; Height: 0.016inch; RoHS Compliant: Yes; ComponentLink1URL: http://www.yageo.com.tw/exep/pages/download/literatures/PYu-R_INT-thick_7.pdf?src-supplier=Digi-Key; ComponentLink1Description: http://www.yageo.com.tw/exep/pages/download/literatures/PYu-R_INT-thick_7.pdf?src-supplier=Digi-Key; ComponentLink2URL: http://www.yageo.com/NewPortal/yageodocoutput?fileName=/pdf/R-Chip/PYu-RC_51_RoHS_P_0.pdf&src-supplier=Digi-Key; ComponentLink2Description: http://www.yageo.com/NewPortal/yageodocoutput?fileName=/pdf/R-Chip/PYu-RC_51_RoHS_P_0.pdf&src-supplier=Digi-Key
R287 R297 R299 R301 = Res_0402: Manufacturer: Yageo; Manufacturer Part Number 1: RC0402FR-0710KL; Part Description: RES SMD 10K OHM 1% 1/16W 0402; Temperature Coefficient: ±100ppm/°C; Power (Watts): 0.063W, 1/16W; Value: 10k, 1%; Supplier 1: Digi-Key; Supplier Part Number 1: 311-10.0KLRTR-ND; Resistance (Ohms): 10k; Packaging: Tape & Reel (TR); RoHS: RoHS Compliant; Package / Case: 0402 (1005 Metric); Tolerance: ±1%; Operating Temperature: -55°C ~ 155°C; Size / Dimension: 0.039" L x 0.020" W (1.00mm x 0.50mm); Number of Terminations: 2; Category: Resistors; Height: 0.016" (0.40mm); Supplier Device Package: 0402; Features: Moisture Resistant; Composition: Thick Film
R298 R300 R302 = Res_0402: Manufacturer: Yageo; Part Description: RES SMD 0.0OHM JUMPER 1/16W 0402; Manufacturer Part Number 1: RC0402JR-070RL; Supplier 1: Digi-Key; Supplier Part Number 1: 311-0.0JRTR-ND; Composition: Thick Film; Package / Case: 0402 (1005 Metric); Category: Resistors; Value: 0R
R303 R304 = Res_0402: Manufacturer Part Number 1: RC0402JR-070RL; Manufacturer: Yageo; Part Description: RES SMD 0.0OHM JUMPER 1/16W 0402; Resistance (Ohms): 0.0; Tolerance: Jumper; Power (Watts): 0.063W, 1/16W; Value: 0R; Supplier 1: Digi-Key; Supplier Part Number 1: 311-0.0JRTR-ND; Category: Resistors; Temperature Coefficient: -; Features: Moisture Resistant; Supplier Device Package: 0402; Height: 0.016" (0.40mm); Package / Case: 0402 (1005 Metric); Operating Temperature: -55°C ~ 155°C; Size / Dimension: 0.039" L x 0.020" W (1.00mm x 0.50mm); Composition: Thick Film; Packaging: Tape & Reel (TR); Number of Terminations: 2; RoHS: RoHS Compliant